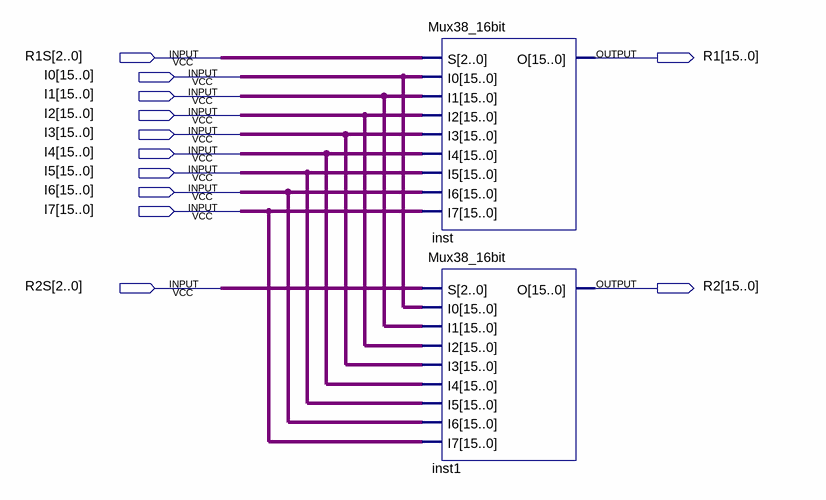
[diagram p0: schematic sheet]
// Quartus schematic ReadDataSelect.bdf as structural Verilog: 2 symbols, 12 pins
module ReadDataSelect (
  input  [2:0] R1S,
  input  [15:0] I0,
  input  [15:0] I1,
  input  [15:0] I2,
  input  [15:0] I3,
  input  [15:0] I4,
  input  [15:0] I5,
  input  [15:0] I6,
  input  [15:0] I7,
  input  [2:0] R2S,
  output [15:0] R1,
  output [15:0] R2
);

  Mux38_16bit inst (.I0(I0), .S(R1S), .I1(I1), .I2(I2), .I3(I3), .I4(I4), .I5(I5), .I6(I6), .I7(I7), .O(R1));
  Mux38_16bit inst1 (.I0(I0), .S(R2S), .I1(I1), .I2(I2), .I3(I3), .I4(I4), .I5(I5), .I6(I6), .I7(I7), .O(R2));
endmodule
